# Altium schematic sheet INTAN_Interface_Top.SchDoc
size Tabloid; SheetNumber: 4; SheetTotal: 5; Sheet_Name: INTAN Interface - Top; Size: 11x17
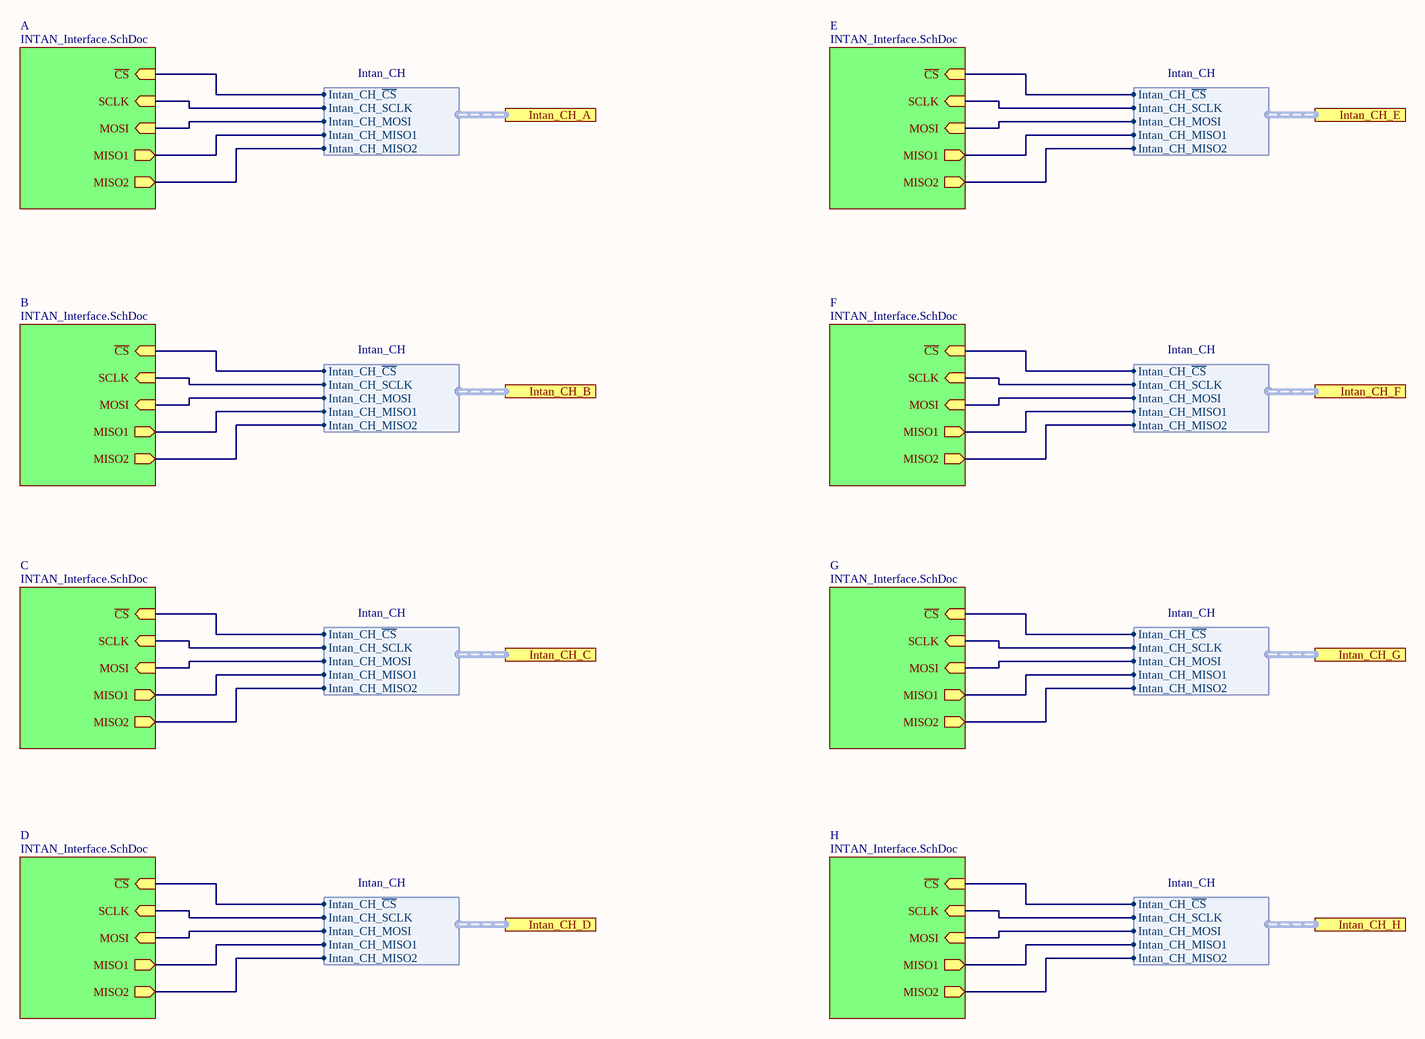
[diagram p0: INTAN_Interface_Top.SchDoc]

## Sub-sheets
A = INTAN_Interface.SchDoc: ~{CS} (in), SCLK (in), MOSI (in), MISO1 (out), MISO2 (out)
B = INTAN_Interface.SchDoc: ~{CS} (in), SCLK (in), MOSI (in), MISO1 (out), MISO2 (out)
C = INTAN_Interface.SchDoc: ~{CS} (in), SCLK (in), MOSI (in), MISO1 (out), MISO2 (out)
D = INTAN_Interface.SchDoc: ~{CS} (in), SCLK (in), MOSI (in), MISO1 (out), MISO2 (out)
E = INTAN_Interface.SchDoc: ~{CS} (in), SCLK (in), MOSI (in), MISO1 (out), MISO2 (out)
F = INTAN_Interface.SchDoc: ~{CS} (in), SCLK (in), MOSI (in), MISO1 (out), MISO2 (out)
G = INTAN_Interface.SchDoc: ~{CS} (in), SCLK (in), MOSI (in), MISO1 (out), MISO2 (out)
H = INTAN_Interface.SchDoc: ~{CS} (in), SCLK (in), MOSI (in), MISO1 (out), MISO2 (out)

## Ports
Intan_CH_A (harness Intan_CH), Intan_CH_B (harness Intan_CH), Intan_CH_C (harness Intan_CH), Intan_CH_D (harness Intan_CH), Intan_CH_E (harness Intan_CH), Intan_CH_F (harness Intan_CH), Intan_CH_G (harness Intan_CH), Intan_CH_H (harness Intan_CH)

## Harnesses
Intan_CH: Intan_CH_~{CS}, Intan_CH_SCLK, Intan_CH_MOSI, Intan_CH_MISO1, Intan_CH_MISO2

## Nets
(unnamed): sheet A/~{CS}, port Intan_CH_A.Intan_CH_~{CS}
(unnamed): sheet A/SCLK, port Intan_CH_A.Intan_CH_SCLK
(unnamed): sheet A/MOSI, port Intan_CH_A.Intan_CH_MOSI
(unnamed): sheet A/MISO1, port Intan_CH_A.Intan_CH_MISO1
(unnamed): sheet A/MISO2, port Intan_CH_A.Intan_CH_MISO2
(unnamed): sheet B/~{CS}, port Intan_CH_B.Intan_CH_~{CS}
(unnamed): sheet B/SCLK, port Intan_CH_B.Intan_CH_SCLK
(unnamed): sheet B/MOSI, port Intan_CH_B.Intan_CH_MOSI
(unnamed): sheet B/MISO1, port Intan_CH_B.Intan_CH_MISO1
(unnamed): sheet B/MISO2, port Intan_CH_B.Intan_CH_MISO2
(unnamed): sheet C/~{CS}, port Intan_CH_C.Intan_CH_~{CS}
(unnamed): sheet C/SCLK, port Intan_CH_C.Intan_CH_SCLK
(unnamed): sheet C/MOSI, port Intan_CH_C.Intan_CH_MOSI
(unnamed): sheet C/MISO1, port Intan_CH_C.Intan_CH_MISO1
(unnamed): sheet C/MISO2, port Intan_CH_C.Intan_CH_MISO2
(unnamed): sheet D/~{CS}, port Intan_CH_D.Intan_CH_~{CS}
(unnamed): sheet D/SCLK, port Intan_CH_D.Intan_CH_SCLK
(unnamed): sheet D/MOSI, port Intan_CH_D.Intan_CH_MOSI
(unnamed): sheet D/MISO1, port Intan_CH_D.Intan_CH_MISO1
(unnamed): sheet D/MISO2, port Intan_CH_D.Intan_CH_MISO2
(unnamed): sheet E/~{CS}, port Intan_CH_E.Intan_CH_~{CS}
(unnamed): sheet E/SCLK, port Intan_CH_E.Intan_CH_SCLK
(unnamed): sheet E/MOSI, port Intan_CH_E.Intan_CH_MOSI
(unnamed): sheet E/MISO1, port Intan_CH_E.Intan_CH_MISO1
(unnamed): sheet E/MISO2, port Intan_CH_E.Intan_CH_MISO2
(unnamed): sheet F/~{CS}, port Intan_CH_F.Intan_CH_~{CS}
(unnamed): sheet F/SCLK, port Intan_CH_F.Intan_CH_SCLK
(unnamed): sheet F/MOSI, port Intan_CH_F.Intan_CH_MOSI
(unnamed): sheet F/MISO1, port Intan_CH_F.Intan_CH_MISO1
(unnamed): sheet F/MISO2, port Intan_CH_F.Intan_CH_MISO2
(unnamed): sheet G/~{CS}, port Intan_CH_G.Intan_CH_~{CS}
(unnamed): sheet G/SCLK, port Intan_CH_G.Intan_CH_SCLK
(unnamed): sheet G/MOSI, port Intan_CH_G.Intan_CH_MOSI
(unnamed): sheet G/MISO1, port Intan_CH_G.Intan_CH_MISO1
(unnamed): sheet G/MISO2, port Intan_CH_G.Intan_CH_MISO2
(unnamed): sheet H/~{CS}, port Intan_CH_H.Intan_CH_~{CS}
(unnamed): sheet H/SCLK, port Intan_CH_H.Intan_CH_SCLK
(unnamed): sheet H/MOSI, port Intan_CH_H.Intan_CH_MOSI
(unnamed): sheet H/MISO1, port Intan_CH_H.Intan_CH_MISO1
(unnamed): sheet H/MISO2, port Intan_CH_H.Intan_CH_MISO2

## Notes on the sheet
- Sheet Name
- Project Title
- Global Project
- Size
- Group
- Revision
- Date
- Sheet
- of
- Filename
- Designers